# Altium schematic sheet GPSDO_Arduino.SchDoc: Arduino
size 420 x 297 mm; EDA_Number: ARTIQ; Projet: GPSDO; Author: G.Kasprowicz; CompanyName: WUT ISE; DrawnBy: G.Kasprowicz; Organization: WUT ISE; Address1: PW ISE; Address2: Nowowiejska 15/19 00-665 Warsaw; Address3: gkasprow@gmail.com; Revision: 1; SheetNumber: -; SheetTotal: -; ModifiedBy: -; CheckedDate: -; DivGrp: WUT ISE; Designer: G.Kasprowicz; ModifiedDate: -; ProjectName: Sensor Box
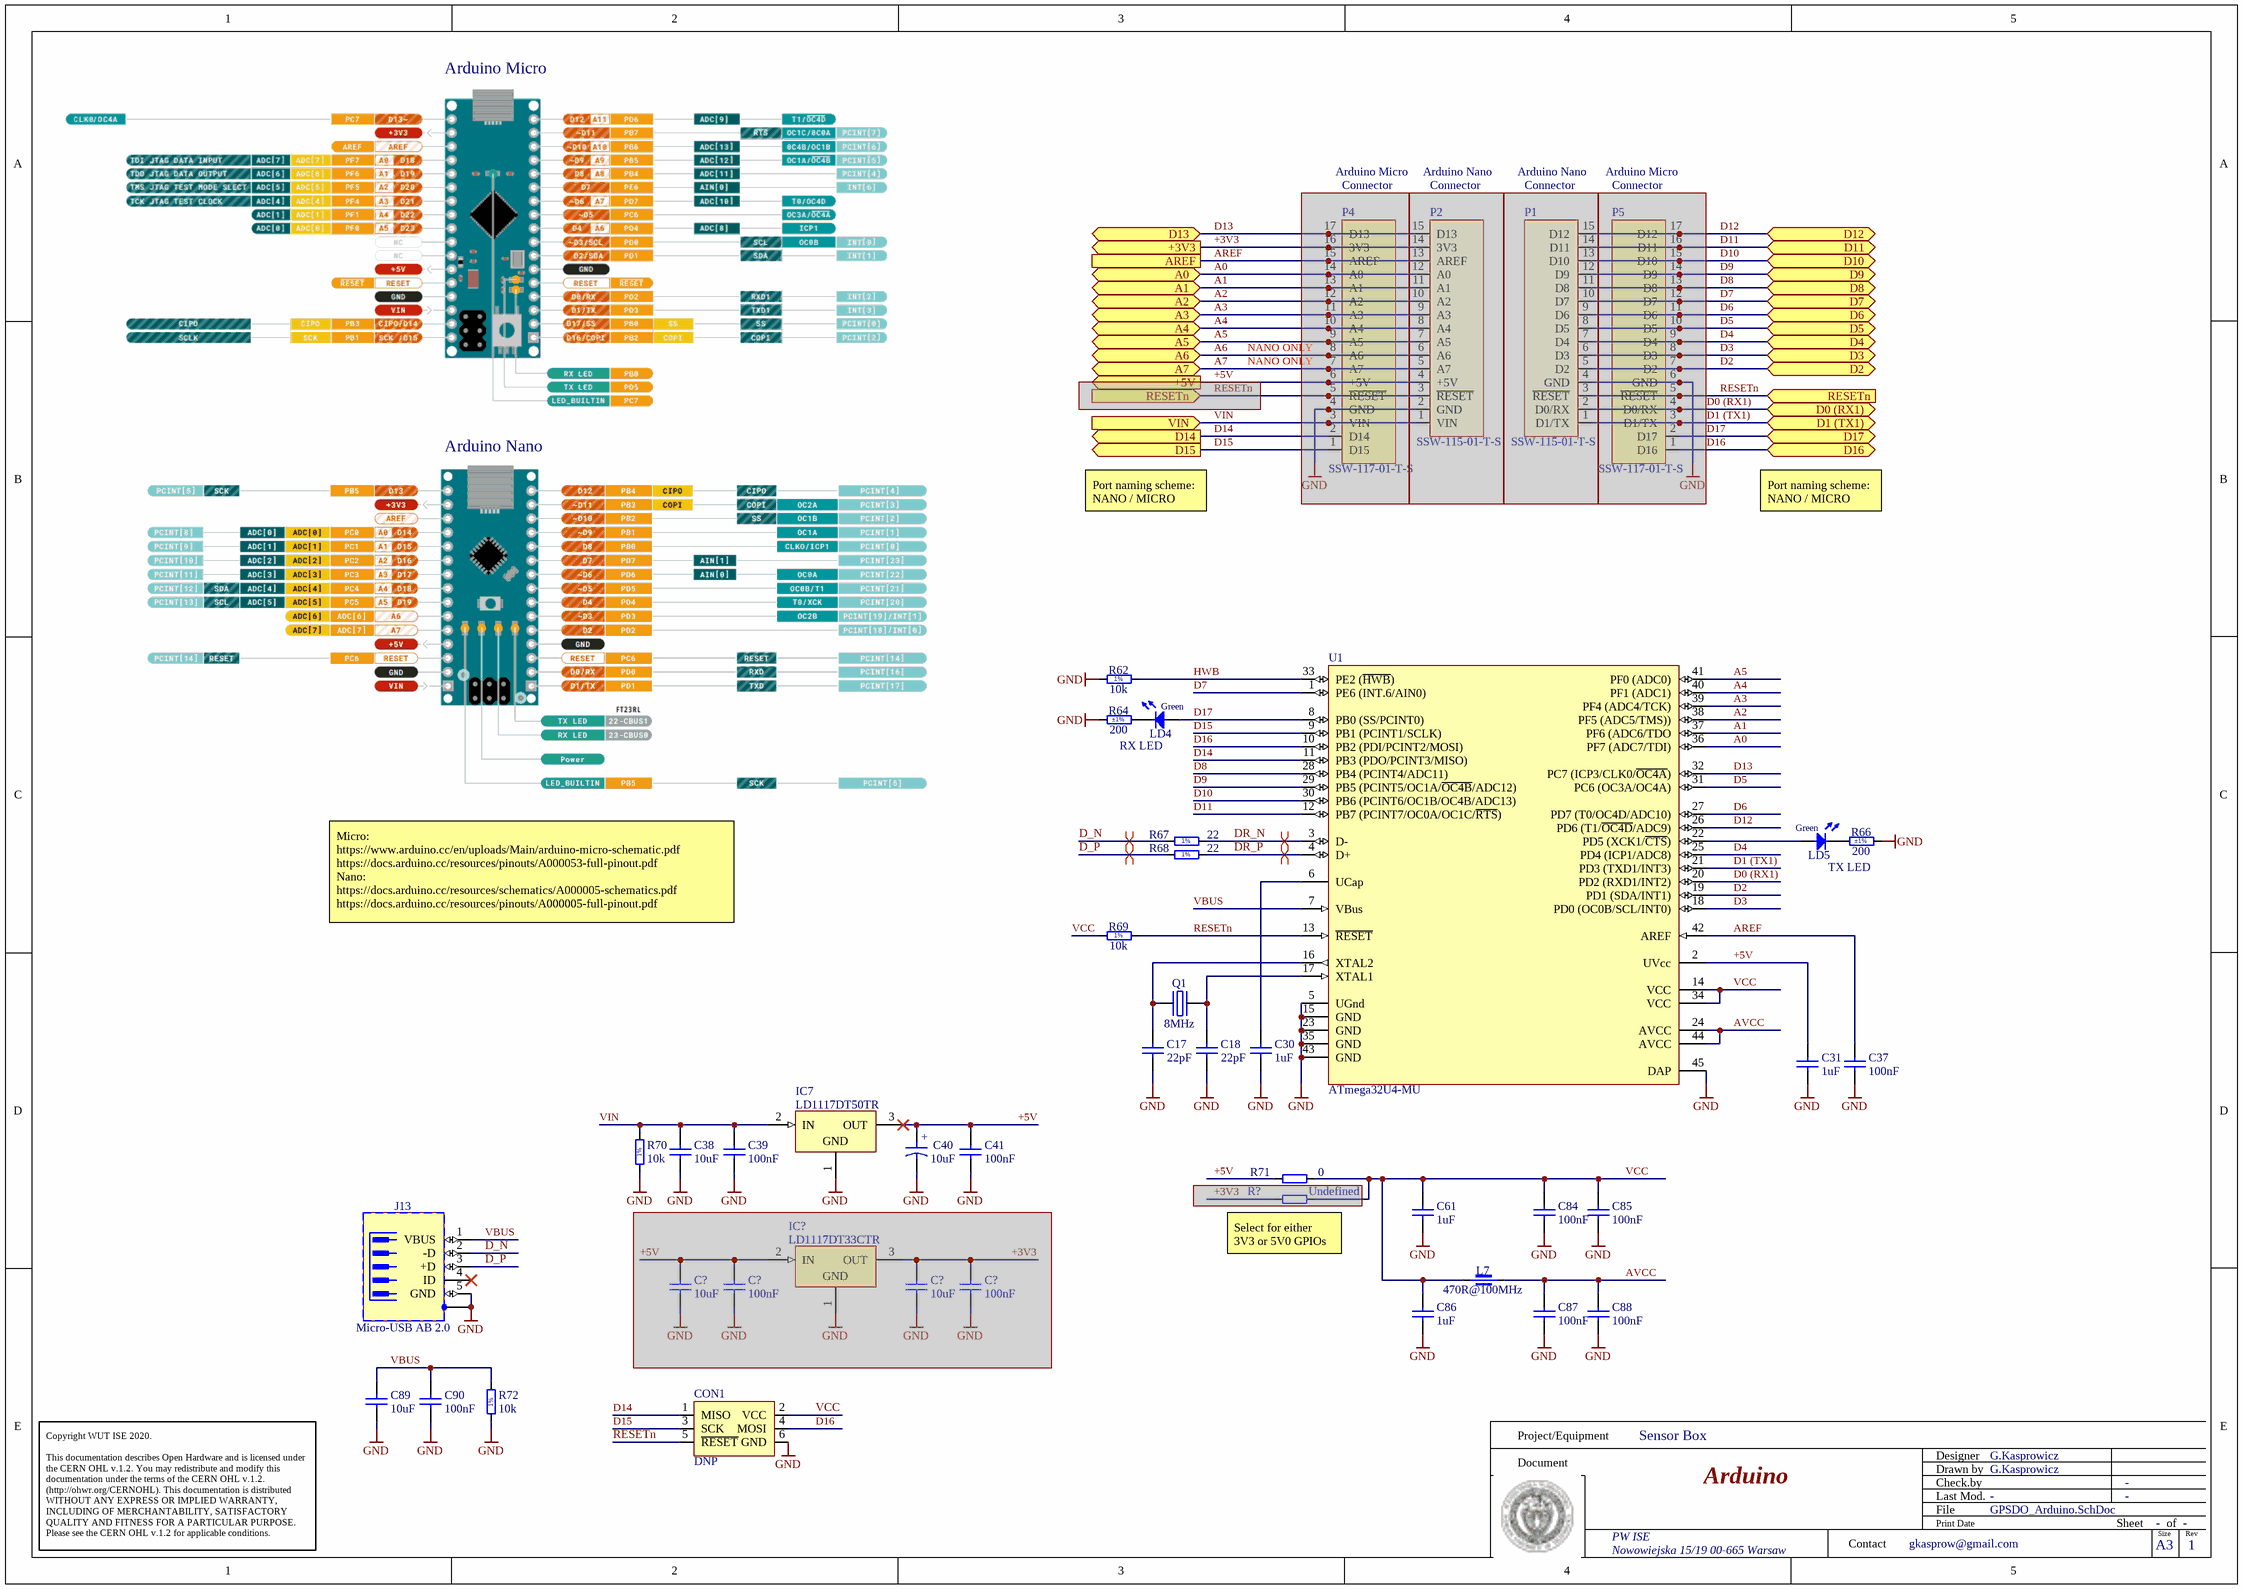
[diagram p0: GPSDO_Arduino.SchDoc]

## Parts
(Parts that share a designator on the sheet are numbered #1, #2 ... from top to bottom, then left to right.)
C17  22pF  [CAPC1005X55N]
C18  22pF  [CAPC1005X55N]
C30  1uF  [CAPC1005X55N]
C31  1uF  [CAPC1005X55N]
C37  100nF  [CAPC1005X55N]
C38  10uF  [CAPC1608X80N]
C39  100nF  [CAPC1005X55N]
C40  10uF  [CAPMP3216X180N]
C41  100nF  [CAPC1005X55N]
C61  1uF  [CAPC1005X55N]
C84  100nF  [CAPC1005X55N]
C85  100nF  [CAPC1005X55N]
C86  1uF  [CAPC1005X55N]
C87  100nF  [CAPC1005X55N]
C88  100nF  [CAPC1005X55N]
C89  10uF  [CAPC1608X80N]
C90  100nF  [CAPC1005X55N]
C?#1  100nF  [CAPC1608X87N]  (masked out: inside a compile mask, not in the netlist)
C?#2  100nF  [CAPC1608X87N]  (masked out: inside a compile mask, not in the netlist)
C?#3  10uF  [CAPC1608X80N]  (masked out: inside a compile mask, not in the netlist)
C?#4  10uF  [CAPC1608X80N]  (masked out: inside a compile mask, not in the netlist)
CON1  DNP  [HEADER3x2]
IC7  LD1117DT50TR  [TO228P972X240-3N-R540X510]
IC?  LD1117DT33CTR  [TO228P972X240-3N-R540X510]  (masked out: inside a compile mask, not in the netlist)
J13  Micro-USB AB 2.0  [HIROSE_ZX62RD-AB-5P8]
L7  470R@100MHz  [INDC1608X95N]
LD4  Green  [LED_KINGBRIGHT_KPH-1608CGCK]
LD5  Green  [LED_KINGBRIGHT_KPH-1608CGCK]
P1  SSW-115-01-T-S  [SSW-115-01-T-S]  (masked out: inside a compile mask, not in the netlist)
P2  SSW-115-01-T-S  [SSW-115-01-T-S]  (masked out: inside a compile mask, not in the netlist)
P4  SSW-117-01-T-S  [SSW-117-01-T-S]  (masked out: inside a compile mask, not in the netlist)
P5  SSW-117-01-T-S  [SSW-117-01-T-S]  (masked out: inside a compile mask, not in the netlist)
Q1  8MHz  [XTAL_TXC_7A]
R62  10k  [RESC1608X55N]
R64  200  Tolerance: ±1%  [RESC1005X40N]
R66  200  Tolerance: ±1%  [RESC1005X40N]
R67  22  [RESC1005X40N]
R68  22  [RESC1005X40N]
R69  10k  [RESC1608X55N]
R70  10k  [RESC1608X55N]
R71  0  [RESC1005X40N]
R72  10k  [RESC1608X55N]
R?  Undefined  [RESC1005X40N]  (masked out: inside a compile mask, not in the netlist)
U1  ATmega32U4-MU  [44PW_M]

## Ports
+3V3 (out), +5V (out), A0 (bidir), A1 (bidir), A2 (bidir), A3 (bidir), A4 (bidir), A5 (bidir), A6 (bidir), A7 (bidir), AREF, D0 (RX1) (bidir), D1 (TX1) (bidir), D2 (bidir), D3 (bidir), D4 (bidir), D5 (bidir), D6 (bidir), D7 (bidir), D8 (bidir), D9 (bidir), D10 (bidir), D11 (bidir), D12 (bidir), D13 (bidir), D14 (out), D15 (out), D16 (bidir), D17 (bidir), RESETn (in), VIN (in)

## Nets
GND: C17.1 C18.1 C30.1 C31.1 C37.1 C38.1 C39.1 C40.2 C41.1 C61.1 C84.1 C85.1 C86.1 C87.1 C88.1 C89.1 C90.1 CON1.6(GND) IC7.1(GND) J13.5(GND) J13.6(SH) R62.1 R64.1 R66.2 R70.1 R72.1 U1.5(UGnd) U1.15(GND) U1.23(GND) U1.35(GND) U1.43(GND) U1.45(DAP)
+3V3: port +3V3
+5V: C31.2 C40.1 C41.2 IC7.3(OUT) R71.2 U1.2(UVcc)
A0: U1.36(PF7_(ADC7/TDI)) ; port A0
A1: U1.37(PF6_(ADC6/TDO) ; port A1
A2: U1.38(PF5_(ADC5/TMS))) ; port A2
A3: U1.39(PF4_(ADC4/TCK)) ; port A3
A4: U1.40(PF1_(ADC1)) ; port A4
A5: U1.41(PF0_(ADC0)) ; port A5
A6: port A6
A7: port A7
AREF: C37.2 U1.42(AREF) ; port AREF
AVCC: C87.2 C88.2 L7.2 U1.24(AVCC) U1.44(AVCC)
D0 (RX1): U1.20(PD2_(RXD1/INT2))
D1 (TX1): U1.21(PD3_(TXD1/INT3))
D2: U1.19(PD1_(SDA/INT1)) ; port D2
D3: U1.18(PD0_(OC0B/SCL/INT0)) ; port D3
D4: U1.25(PD4_(ICP1/ADC8)) ; port D4
D5: U1.31(PC6_(OC3A/OC4A)) ; port D5
D6: U1.27(PD7_(T0/OC4D/ADC10)) ; port D6
D7: U1.1(PE6_(INT.6/AIN0)) ; port D7
D8: U1.28(PB4_(PCINT4/ADC11)) ; port D8
D9: U1.29(PB5_(PCINT5/OC1A/~{OC4B}/ADC12)) ; port D9
D10: U1.30(PB6_(PCINT6/OC1B/OC4B/ADC13)) ; port D10
D11: U1.12(PB7_(PCINT7/OC0A/OC1C/~{RTS})) ; port D11
D12: U1.26(PD6_(T1/~{OC4D}/ADC9)) ; port D12
D13: U1.32(PC7_(ICP3/CLK0/~{OC4A})) ; port D13
D14: CON1.1(MISO) U1.11(PB3_(PDO/PCINT3/MISO)) ; port D14
D15: CON1.3(SCK) U1.9(PB1_(PCINT1/SCLK)) ; port D15
D16: CON1.4(MOSI) U1.10(PB2_(PDI/PCINT2/MOSI))
D17: LD4.2(A) U1.8(PB0_(SS/PCINT0))
D_N: J13.2(-D) R67.1
D_P: J13.3(+D) R68.1
DR_N: R67.2 U1.3(D-)
DR_P: R68.2 U1.4(D+)
HWB: R62.2 U1.33(PE2_(~{HWB}))
RESETn: CON1.5(~{RESET}) R69.2 U1.13(~{RESET}) ; port RESETn
VBUS: C89.2 C90.2 J13.1(VBUS) R72.2 U1.7(VBus)
VCC: C61.2 C84.2 C85.2 C86.2 CON1.2(VCC) L7.1 R69.1 R71.1 U1.14(VCC) U1.34(VCC)
VIN: C38.2 C39.2 IC7.2(IN) R70.2 ; port VIN
NetC17_2: C17.2 Q1.1(OSC1) U1.16(XTAL2)
NetC18_2: C18.2 Q1.2(OSC2) U1.17(XTAL1)
NetC30_2: C30.2 U1.6(UCap)
NetLD4_1: LD4.1(C) R64.2
NetLD5_1: LD5.1(C) R66.1
NetLD5_2: LD5.2(A) U1.22(PD5_(XCK1/~{CTS}))

Not connected (* = marked no-connect by the designer): J13 4(ID)*

## Layout directives
differential pair: D_N, D_P, DR_N, DR_P

## Notes on the sheet
- Arduino Micro
- Connector
- Arduino Nano
- (near P2) Connector
- (near P1) Connector
- (near P4) NANO ONLY
- Port naming scheme:
  NANO / MICRO
- RX LED
- Micro:
  https://www.arduino.cc/en/uploads/Main/arduino-micro-schematic.pdf
  https://docs.arduino.cc/resources/pinouts/A000053-full-pinout.pdf
  Nano:
  https://docs.arduino.cc/resources/schematics/A000005-schematics.pdf
  https://docs.arduino.cc/resources/pinouts/A000005-full-pinout.pdf
- TX LED
- (near R?) Select for either 3V3 or 5V0 GPIOs
- Project/Equipment
- Document
- Designer
- Drawn by
- Check.by
- Copyright WUT ISE 2020.
  This documentation describes Open Hardware and is licensed under the CERN OHL v.1.2. You may redistribute and modify this documentation under the terms of the CERN OHL v.1.2. (http://ohwr.org/CERNOHL). This documentation is distributed WITHOUT ANY EXPRESS OR IMPLIED WARRANTY, INCLUDING OF MERCHANTABILITY, SATISFACTORY QUALITY AND FITNESS FOR A PARTICULAR PURPOSE. Please see the CERN OHL v.1.2 for applicable conditions.
- Contact
- File
- Last Mod.
- Print Date
- Sheet
- Size
- A3
- of
- Rev
- (in symbol CTE3216-18_10UF_16V_20%_AVX_TCJ) +
- (in symbol R0402_22R_1%_0.0625W_100PPM) 1%
- (in symbol R0603_10K_1%_0.1W_100PPM) 1%

## Library data of the parts
C17 C18 = CC0402_22PF_50V_5%_C0G: Non-polarised capacitor; Part Description: SMD Multilayer Chip Ceramic Capacitor; Manufacturer: GENERIC; Manufacturer1 Part Number: C0402C220J5GACTU; Voltage: 50V; TC: C0G/NP0; Tolerance: ±5%; Part Number: CC0402_22PF_50V_5%_C0G; Component Kind: Standard; Component Type: Standard; Pin Count: 2; Value: 22pF; Status: Preferred; Manufacturer Part Number: CC0402_22PF_50V_5%_C0G; Case: 0402; Mounted: Yes; Socket: No; SMD: Yes; Manufacturer1 Example: KEMET; Manufacturer1 ComponentHeight: 0.55mm; HelpURL: \\cern.ch\dfs\Applications\Altium\Datasheets\CC0402_C0G_KEMET_(Commercial Grade).pdf; Author: CERN DEM JLC; CreateDate: 2007-12-03; LatestRevisionDate: 2007-12-03; Sense: No
C30 C31 C61 C86 = CC0402_1UF_16V_10%_X5R: Non-polarised capacitor; Part Description: SMD Multilayer Chip Ceramic Capacitor; Manufacturer: GENERIC; Manufacturer1 Part Number: C1005X5R1C105KT; Voltage: 16V; TC: X5R; Tolerance: ±10%; Part Number: CC0402_1UF_16V_10%_X5R; Component Kind: Standard; Component Type: Standard; Pin Count: 2; Value: 1uF; Status: Preferred; Manufacturer Part Number: CC0402_1UF_16V_10%_X5R; Case: 0402; Mounted: Yes; Socket: No; SMD: Yes; Sense: No; Manufacturer1 Example: TDK; Manufacturer1 ComponentHeight: 0.55mm; HelpURL: \\cern.ch\dfs\Applications\Altium\Datasheets\CC0402_X5R_TDK_C.pdf; Author: CERN DEM JLC; CreateDate: 25.10.2012; LatestRevisionDate: 25.10.2012
C37 C39 C41 C84 C85 C87 C88 C90 = CC0402_100NF_16V_10%_X5R: Non-polarised capacitor; Part Description: SMD Multilayer Chip Ceramic Capacitor; Manufacturer: GENERIC; Manufacturer1 Part Number: GRM155R61C104KA88D; Voltage: 16V; TC: X5R; Tolerance: ±10%; Part Number: CC0402_100NF_16V_10%_X5R; Component Kind: Standard; Component Type: Standard; Pin Count: 2; Value: 100nF; Status: None; Manufacturer Part Number: CC0402_100NF_16V_10%_X5R; Case: 0402; Mounted: Yes; Socket: No; SMD: Yes; Sense: No; Manufacturer1 Example: MURATA; Manufacturer1 ComponentHeight: 0.55mm; HelpURL: \\cern.ch\dfs\Applications\Altium\Datasheets\CC0402_X5R_MURATA_GRM.pdf; Author: CERN DEM JLC; CreateDate: 10.12.2013; LatestRevisionDate: 10.12.2013
C38 C89 C?#3 C?#4 = CC0603_10UF_10V_10%_X5R: Non-polarised capacitor; Part Description: SMD Multilayer Chip Ceramic Capacitor; Manufacturer: GENERIC; Manufacturer1 Part Number: GRM188R61A106KE69D; Voltage: 10V; TC: X5R; Tolerance: ±10%; Part Number: CC0603_10UF_10V_10%_X5R; Component Kind: Standard; Component Type: Standard; Pin Count: 2; Value: 10uF; Status: None; Manufacturer Part Number: CC0603_10UF_10V_10%_X5R; Case: 0603; Mounted: Yes; Socket: No; SMD: Yes; Sense: No; Manufacturer1 Example: MURATA; Manufacturer1 ComponentHeight: 0.8mm; HelpURL: \\cern.ch\dfs\Applications\Altium\Datasheets\CC0603_MURATA_GRM188R61A106KE69D.pdf; Author: CERN DEM JLC; CreateDate: 31.01.2017; LatestRevisionDate: 31.01.2017
C40 = CTE3216-18_10UF_16V_20%_AVX_TCJ: Polarised capacitor; Part Description: ESR 0R200 Tantalum Solid Electrolytic Chip Capacitor with Conductive Polymer Electrode; Manufacturer: AVX; Manufacturer Part Number: TCJA106M016R0200 or  or TR3A106K016C1700; Voltage: 16V; Tolerance: ±20%; Part Number: CTE3216-18_10UF_16V_20%_AVX_TCJ; Component Kind: Standard; Component Type: Standard; Pin Count: 2; Value: 10uF; Status: Preferred; Case: A; Mounted: Yes; Socket: No; SMD: Yes; Sense: No; ComponentHeight: 1.8mm; HelpURL: \\cern.ch\dfs\Applications\Altium\Datasheets\CTE_AVX_TCJ.pdf; Author: CERN DEM JLC; CreateDate: 29.03.2012; LatestRevisionDate: 29.03.2012
C?#1 C?#2 = CC0603_100NF_50V_10%_X5R: Non-polarised capacitor; Part Description: SMD Multilayer Chip Ceramic Capacitor; Manufacturer: GENERIC; Manufacturer1 Part Number: C1608X5R1H104K080AA; Voltage: 50V; TC: X5R; Tolerance: ±10%; Part Number: CC0603_100NF_50V_10%_X5R; Component Kind: Standard; Component Type: Standard; Pin Count: 2; Value: 100nF; Status: None; Manufacturer Part Number: CC0603_100NF_50V_10%_X5R; Case: 0603; Mounted: Yes; Socket: No; SMD: Yes; Sense: No; Manufacturer1 Example: TDK; Manufacturer1 ComponentHeight: 0.9mm; HelpURL: \\cern.ch\dfs\Applications\Altium\Datasheets\CC0603_X5R_TDK_C.pdf; Author: CERN DEM MR; CreateDate: 08.01.2016; LatestRevisionDate: 08.01.2016
CON1 = CON_ISP: 6x 2.54mm SMT  dual row pin header
IC7 = LD1117DT50TR: 3-Terminal Regulator 1=GND 2=IN 3=OUT; Part Description: 5V 800mA Low drop fixed positive voltage regulators; Manufacturer: ST MICROELECTRONICS; PressFit: No; Bonding: No; Part Number: LD1117DT50TR; Component Kind: Standard; Component Type: Standard; Device: LD1117DT50TR; PackageDescription: TO-252 DPAK TO, 2.28mm Pitch; 2 Pin, 9.725mm L X 6.10mm W X 2.40mm H body, IPC Medium Density; Manufacturer Part Number: LD1117DT50TR; Pin Count: 3; Case: DPAK; Mounted: Yes; Socket: No; SMD: Yes; Sense: No; ComponentHeight: 2.4mm; HelpURL: \\cern.ch\dfs\Applications\Altium\Datasheets\LD1117DT50TR.pdf; Author: CERN DEM JLC; CreateDate: 20/09/2010; LatestRevisionDate: 20/09/2010
IC? = LD1117DT33CTR: 3-Terminal Regulator 1=GND 2=IN 3=OUT; Part Description: 3.3V 800mA Low drop fixed and adjustable positive voltage regulators; Manufacturer: ST MICROELECTRONICS; PressFit: No; Bonding: No; Part Number: LD1117DT33CTR; Component Kind: Standard; Component Type: Standard; Device: LD1117DT33CTR; PackageDescription: DPAK TO-252, 2.28mm pitch; 2 pin, 9.725mm L X 6.10mm W X 2.40mm H body, IPC Medium Density; Manufacturer Part Number: LD1117DT33CTR; Pin Count: 3; Case: DPAK; Mounted: Yes; Socket: No; SMD: Yes; Sense: No; ComponentHeight: 2.4mm; HelpURL: \\cern.ch\dfs\Applications\Altium\Datasheets\LD1117DT33CTR.pdf; Author: CERN DEM JLC; CreateDate: 08.06.2011; LatestRevisionDate: 08.06.2011
J13 = HIROSE_ZX62RD-AB-5P8: 5 Pin + 1 Shield USB Receptacle; Part Description: Micro-USB 2.0 Right Angle, SMD Type AB - Reverse (Top mount), Shell Through Hole; Manufacturer: HIROSE (HRS); PressFit: No; Part Number: HIROSE_ZX62RD-AB-5P8; Component Kind: Standard; Component Type: Standard; Pin Count: 7; Family: Micro-USB AB 2.0; Mounted: Yes; Socket: No; SMD: Yes; Sense: No; Status: None; Manufacturer Part Number: ZX62RD-AB-5P8; ComponentHeight: 2.35mm; HelpURL: \\cern.ch\dfs\Applications\Altium\Datasheets\HIROSE_ZX62RD-AB-5P8.pdf; ComponentLink1URL: \\cern.ch\dfs\Applications\Altium\Datasheets\HIROSE_ZX62RD-AB-5P8_Package-Drawing.pdf; ComponentLink1Description: Package-Drawing; Author: CERN DEM JLC; CreateDate: 29.10.2014; LatestRevisionDate: 29.10.2014; ClassName: Connectors
L7 = IND0603_MURATA_BLM18PG471SN1D: Part Description: SMD EMIFIL Chip Ferrite Bead; Manufacturer: MURATA; Power: 1A; Resistance: 0.2R; Tolerance: ±25%; Part Number: IND0603_MURATA_BLM18PG471SN1D; Component Kind: Standard; Component Type: Standard; Pin Count: 2; Value: 470R@100MHz; Manufacturer Part Number: BLM18PG471SN1D; Case: 0603; Mounted: Yes; Socket: No; SMD: Yes; Sense: No; ComponentHeight: 0.95mm; HelpURL: \\cern.ch\dfs\Applications\Altium\Datasheets\IND0603_MURATA_BLM18P.pdf; Author: CERN DEM BC; CreateDate: 17.02.2021; LatestRevisionDate: 17.02.2021
LD4 LD5 = LED_KINGBRIGHT_KPH-1608CGCK: LED Green 1C 2A; Part Description: SMD Green LED, Case 1.6mmX0.8mm(0603), 0.65mm Thickness; PressFit: No; Bonding: No; Part Number: LED_KINGBRIGHT_KPH-1608CGCK; Component Kind: Standard; Component Type: Standard; Color: Green; PackageDescription: SMT Green LED, Case 0603, Body L 1.6 x W 0.8mm H 0.65mm; Manufacturer: KINGBRIGHT; Manufacturer Part Number: KPH-1608CGCK; Pin Count: 2; Mounted: Yes; Socket: No; SMD: Yes; Sense: No; ComponentHeight: 0.65mm; HelpURL: \\cern.ch\dfs\Applications\Altium\Datasheets\LED_KINGBRIGHT_KPH-1608CGCK.pdf; Author: CERN DEM JLC; CreateDate: 03.07.2017; LatestRevisionDate: 03.07.2017
P1 = Arduino_Nano_Socket_A: Manufacturer1: Samtec; Part Number: SSW-115-01-T-S; Manufacturer1 Part Number: SSW-115-01-T-S
P2 = Arduino_Nano_Socket_B: Manufacturer1: Samtec; Part Number: SSW-115-01-T-S; Manufacturer1 Part Number: SSW-115-01-T-S
P4 = Arduino_Micro_Socket_B: Manufacturer1: Samtec; Part Number: SSW-117-01-T-S; Manufacturer1 Part Number: SSW-117-01-T-S
P5 = Arduino_Micro_Socket_A: Manufacturer1: Samtec; Part Number: SSW-117-01-T-S; Manufacturer1 Part Number: SSW-117-01-T-S
Q1 = XTAL_8MHZ_TXC_7A-8.000MAAE-T: Quartz Crystal; Part Description: Tolerance: ±30ppm, Stability: ±30ppm, -20°C to +70°C, 12pF, SMD Glass Seam Sealing Crystal, 7A Series; Manufacturer: TXC CORPORATION; PressFit: No; Bonding: No; Part Number: XTAL_8MHZ_TXC_7A-8.000MAAE-T; Component Kind: Standard; Component Type: Standard; PackageDescription: 2 Pins, 3.2x5mm, SMD Glass Seam Sealing Crystal, 7A Serie; Value: 8MHz; Manufacturer Part Number: 7A-8.000MAAE-T; Pin Count: 2; Mounted: Yes; Socket: No; SMD: Yes; Sense: No; ComponentHeight: 1.2mm; HelpURL: \\cern.ch\dfs\Applications\Altium\Datasheets\XTAL_TXC_7A.pdf; Author: CERN DEM JLC; CreateDate: 09.10.2014; LatestRevisionDate: 12.11.2014
R62 R69 R70 R72 = R0603_10K_1%_0.1W_100PPM: Resistor - 1%; Part Description: General Purpose Thick Film Chip Resistor; Manufacturer: GENERIC; Manufacturer1 Part Number: NRC06F1002TRF; Power: 0.1W; TC: ±100ppm/°C; PressFit: No; Part Number: R0603_10K_1%_0.1W_100PPM; Component Kind: Standard; Component Type: Standard; Pin Count: 2; Value: 10k; Status: Preferred; Tolerance: ±1%; Manufacturer Part Number: R0603_10K_1%_0.1W_100PPM; Case: 0603; Mounted: Yes; Sense: No; Socket: No; SMD: Yes; Manufacturer1 Example: NIC COMPONENT; Manufacturer1 ComponentHeight: 0.55mm; HelpURL: \\cern.ch\dfs\Applications\Altium\Datasheets\R0603_NIC_NRC.pdf; Author: CERN DEM JLC; CreateDate: 03.12.2007; LatestRevisionDate: 13.03.2008
R64 R66 = R0402_200R_1%_0.0625W_100PPM: Resistor - 1%; Part Description: General Purpose Thick Film Chip Resistor; Manufacturer: GENERIC; Manufacturer1 Part Number: 232270672001L; TC: ±100ppm/°C; PressFit: No; Part Number: R0402_200R_1%_0.0625W_100PPM; Component Kind: Standard; Component Type: Standard; Pin Count: 2; Value: 200; Status: Not Recommended; Power: 0.0625W; Manufacturer Part Number: R0402_200R_1%_0.0625W_100PPM; Case: 0402; Mounted: Yes; Sense: No; Socket: No; SMD: Yes; Manufacturer1 Example: YAGEO PHYCOMP; Manufacturer1 ComponentHeight: 0.4mm; HelpURL: \\cern.ch\dfs\Applications\Altium\Datasheets\R0402_Phycomp_RC0402.pdf; Author: CERN DEM JLC; CreateDate: 03.12.2007; LatestRevisionDate: 17.10.2012
R67 R68 = R0402_22R_1%_0.0625W_100PPM: Resistor - 1%; Part Description: General Purpose Thick Film Chip Resistor; Manufacturer: GENERIC; Manufacturer1 Part Number: 232270672209L; PressFit: No; Part Number: R0402_22R_1%_0.0625W_100PPM; Component Kind: Standard; Component Type: Standard; Pin Count: 2; Value: 22; Status: Not Recommended; Power: 0.0625W; Tolerance: ±1%; Manufacturer Part Number: R0402_22R_1%_0.0625W_100PPM; Case: 0402; Mounted: Yes; Socket: No; SMD: Yes; Manufacturer1 Example: YAGEO PHYCOMP; Manufacturer1 ComponentHeight: 0.4mm; HelpURL: \\cern.ch\dfs\Applications\Altium\Datasheets\R0402_Phycomp_RC0402.pdf; Author: CERN DEM JLC; CreateDate: 03.12.2007; LatestRevisionDate: 17.10.2012; Sense: No
R71 = R0402_0R_JUMPER: Resistor; Part Description: 1A (0.05R Max DC Resistance) Zero Ohm Jumper; Manufacturer: GENERIC; Manufacturer1 Part Number: 232270591001L; PressFit: No; Part Number: R0402_0R_JUMPER; Component Kind: Standard; Component Type: Standard; Pin Count: 2; Value: 0; Status: Not Recommended; Manufacturer Part Number: R0402_0R_JUMPER; Case: 0402; Mounted: Yes; Socket: No; SMD: Yes; Manufacturer1 Example: YAGEO PHYCOMP; Manufacturer1 ComponentHeight: 0.4mm; HelpURL: \\cern.ch\dfs\Applications\Altium\Datasheets\R0402_Phycomp_RC0402.pdf; Author: CERN DEM JLC; CreateDate: 03.12.2007; LatestRevisionDate: 17.10.2012; Sense: No
R? = R0402_NO-VALUE: Resistor; Part Description: Reserved Footprint For a 0402 (1005) Chip Resistor; Mounted: No; Part Number: R0402_NO-VALUE; Component Kind: Standard; Component Type: Standard; Pin Count: 2; Value: Undefined; Status: None; Manufacturer: Undefined; Manufacturer Part Number: R0402_NO-VALUE; Case: 0402; Sense: No; Socket: No; SMD: Yes; Manufacturer1 Example: Undefined; Manufacturer1 Part Number: Undefined; Manufacturer1 ComponentHeight: Undefined; HelpURL: Undefined; Author: CERN DEM JLC; CreateDate: 03.12.2007; LatestRevisionDate: 13.03.2008
U1 = CMP-0095-00166-2: 8-bit AVR Microcontroller, 2.7-5.5V, 16MHz, 32KB Flash, 1KB EEPROM, 2.5KB SRAM, USB Controller, 44-pin QFN, Industrial Grade (-40°C to 85°C), Ext Osc; PackageVersion: revG, Sep-2009; PackageReference: 44PW; ComponentLink1URL: http://www.atmel.com/; PackageDescription: 44-Pin Quad Flat No-Lead Package, 7 x 7 mm Body, 0.5 mm Pitch (QFN); ComponentLink3Description: ATmega16U4 ATmega32U4 Summary; RevisionNote: DatasheetVersion, PackageVersion & PCB updated. URLs added.; ComponentLink2Description: ATmega16U4/32U4 Datasheet; ComponentLink1Description: Manufacturer URL; ComponentLink3URL: http://www.atmel.com/dyn/resources/prod_documents/7766S.pdf; DatasheetVersion: revF, Nov-2010; ComponentLink2URL: http://www.atmel.com/dyn/resources/prod_documents/doc7766.pdf; Code_JEDEC: MO-220-VKKD-1; Part Number: ATmega32U4-MU